# Altium schematic sheet TP_IHM_CONNECTOR.SchDoc
size A4
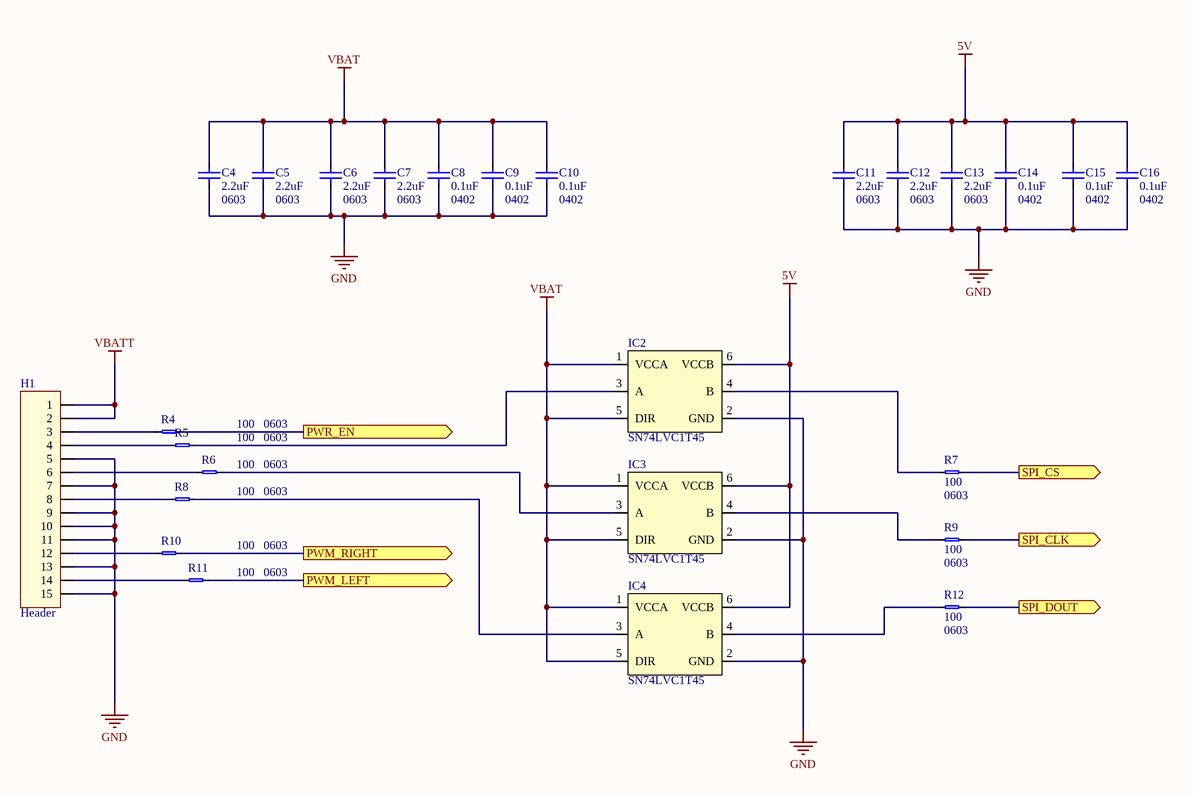
[diagram p0: TP_IHM_CONNECTOR.SchDoc]

## Parts
C4  value 2.2uF  Package: 0603  [0603_CAP_LD]  (hidden comment: CerCap)
C5  value 2.2uF  Package: 0603  [0603_CAP_LD]  (hidden comment: CerCap)
C6  value 2.2uF  Package: 0603  [0603_CAP_LD]  (hidden comment: CerCap)
C7  value 2.2uF  Package: 0603  [0603_CAP_LD]  (hidden comment: CerCap)
C8  value 0.1uF  Package: 0402  [0603_CAP_LD]  (hidden comment: CerCap)
C9  value 0.1uF  Package: 0402  [0603_CAP_LD]  (hidden comment: CerCap)
C10  value 0.1uF  Package: 0402  [0603_CAP_LD]  (hidden comment: CerCap)
C11  value 2.2uF  Package: 0603  [0603_CAP_LD]  (hidden comment: CerCap)
C12  value 2.2uF  Package: 0603  [0603_CAP_LD]  (hidden comment: CerCap)
C13  value 2.2uF  Package: 0603  [0603_CAP_LD]  (hidden comment: CerCap)
C14  value 0.1uF  Package: 0402  [0603_CAP_LD]  (hidden comment: CerCap)
C15  value 0.1uF  Package: 0402  [0603_CAP_LD]  (hidden comment: CerCap)
C16  value 0.1uF  Package: 0402  [0603_CAP_LD]  (hidden comment: CerCap)
H1  Header  [653115131822]
IC2  SN74LVC1T45  [MO-203AB_LD]
IC3  SN74LVC1T45  [MO-203AB_LD]
IC4  SN74LVC1T45  [MO-203AB_LD]
R4  Precision: 100  Package: 0603  [0603_RES_LD]  (hidden comment: Resistor)
R5  Precision: 100  Package: 0603  [0603_RES_LD]  (hidden comment: Resistor)
R6  Precision: 100  Package: 0603  [0603_RES_LD]  (hidden comment: Resistor)
R7  value 100  Package: 0603  [0603_RES_LD]  (hidden comment: Resistor)
R8  Precision: 100  Package: 0603  [0603_RES_LD]  (hidden comment: Resistor)
R9  value 100  Package: 0603  [0603_RES_LD]  (hidden comment: Resistor)
R10  Precision: 100  Package: 0603  [0603_RES_LD]  (hidden comment: Resistor)
R11  Precision: 100  Package: 0603  [0603_RES_LD]  (hidden comment: Resistor)
R12  value 100  Package: 0603  [0603_RES_LD]  (hidden comment: Resistor)

## Ports
PWM_LEFT (out), PWM_RIGHT (out), PWR_EN (out), SPI_CLK (out), SPI_CS (out), SPI_DOUT (out)

## Nets
5V: C11.2 C12.2 C13.2 C14.2 C15.2 C16.2 IC2.6(VCCB) IC3.6(VCCB) IC4.6(VCCB)
GND: C4.1 C5.1 C6.1 C7.1 C8.1 C9.1 C10.1 C11.1 C12.1 C13.1 C14.1 C15.1 C16.1 H1.5 H1.7 H1.9 H1.10 H1.11 H1.13 H1.15 IC2.2(GND) IC3.2(GND) IC4.2(GND)
VBAT: C4.2 C5.2 C6.2 C7.2 C8.2 C9.2 C10.2 IC2.1(VCCA) IC2.5(DIR) IC3.1(VCCA) IC3.5(DIR) IC4.1(VCCA) IC4.5(DIR)
VBATT: H1.1 H1.2
PWM_LEFT: R11.2 ; port PWM_LEFT
PWM_RIGHT: R10.2 ; port PWM_RIGHT
PWR_EN: R4.2 ; port PWR_EN
SPI_CLK: R9.2 ; port SPI_CLK
SPI_CS: R7.2 ; port SPI_CS
SPI_DOUT: R12.2 ; port SPI_DOUT
NetH1_3: H1.3 R4.1
NetH1_4: H1.4 R5.1
NetH1_6: H1.6 R6.1
NetH1_8: H1.8 R8.1
NetH1_12: H1.12 R10.1
NetH1_14: H1.14 R11.1
NetIC2_3: IC2.3(A) R5.2
NetIC2_4: IC2.4(B) R7.1
NetIC3_3: IC3.3(A) R6.2
NetIC3_4: IC3.4(B) R9.1
NetIC4_3: IC4.3(A) R8.2
NetIC4_4: IC4.4(B) R12.1

## Library data of the parts
C4-C16 = CerCap: Ceramic Capacitor; Type: *; Voltage/Power: *
H1 = HEADER_15x1: Header 15x1
IC2-IC4 = SN74LVC1T45: Single Bit Dual Supply Buffer
R4-R6 R8 R10 R11 = Resistor: Value: 10k
R7 R9 R12 = Resistor: Precision: *